# Altium schematic sheet EMoC_Hardware.SchDoc
size A4
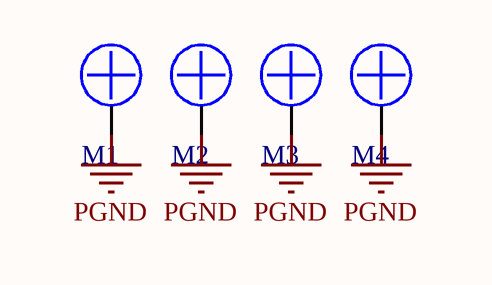
[diagram p0: EMoC_Hardware.SchDoc]

## Parts
M1  Mounting_Screw  [MOUNT_HOLE_3.2]  (value not drawn)
M2  Mounting_Screw  [MOUNT_HOLE_3.2]  (value not drawn)
M3  Mounting_Screw  [MOUNT_HOLE_3.2]  (value not drawn)
M4  Mounting_Screw  [MOUNT_HOLE_3.2]  (value not drawn)

## Nets
PGND: M1.1 M2.1 M3.1 M4.1